# Altium schematic sheet VCO_TOP.SchDoc
size A4
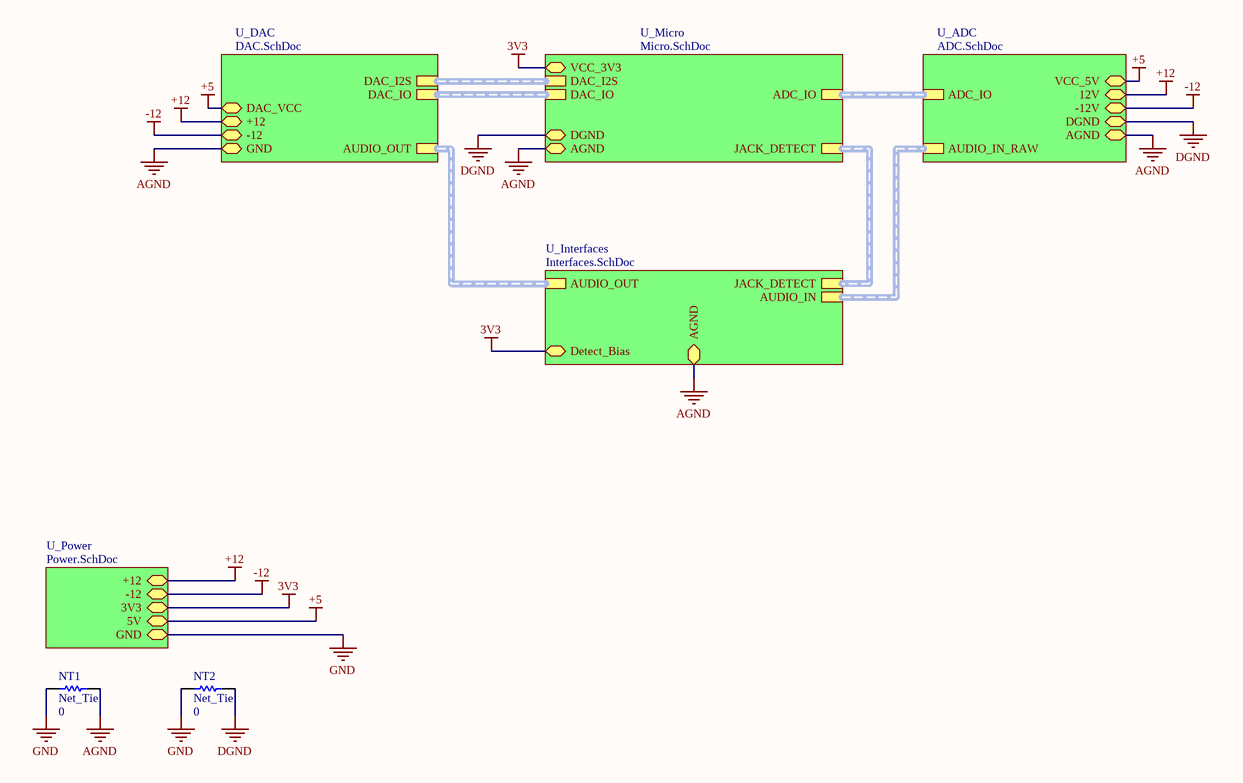
[diagram p0: VCO_TOP.SchDoc]

## Parts
NT1  Net_Tie  value 0  [RES0603R]
NT2  Net_Tie  value 0  [RES0603R]

## Sub-sheets
U_ADC = ADC.SchDoc: AGND (bidir), VCC_5V (bidir), DGND (bidir), ADC_IO (harness ADC_IO), -12V (bidir), 12V (bidir), AUDIO_IN_RAW (harness AUDIO_IN)
U_DAC = DAC.SchDoc: DAC_I2S (harness DAC_I2S), DAC_VCC (bidir), GND (bidir), DAC_IO (harness DAC_IO), -12 (bidir), +12 (bidir), AUDIO_OUT (harness AUDIO_OUT)
U_Interfaces = Interfaces.SchDoc: AGND (bidir), Detect_Bias (bidir), JACK_DETECT (harness JACK_DETECT), AUDIO_OUT (harness AUDIO_OUT), AUDIO_IN (harness AUDIO_IN)
U_Micro = Micro.SchDoc: VCC_3V3 (bidir), DAC_I2S (harness DAC_I2S), DAC_IO (harness DAC_IO), JACK_DETECT (harness JACK_DETECT), ADC_IO (harness ADC_IO), DGND (bidir), AGND (bidir)
U_Power = Power.SchDoc: +12 (bidir), -12 (bidir), GND (bidir), 3V3 (bidir), 5V (bidir)

## Nets
3V3: sheet U_Power/3V3, sheet U_Micro/VCC_3V3, sheet U_Interfaces/Detect_Bias
+5: sheet U_Power/5V, sheet U_DAC/DAC_VCC, sheet U_ADC/VCC_5V
+12: sheet U_Power/+12, sheet U_DAC/+12, sheet U_ADC/12V
-12: sheet U_Power/-12, sheet U_DAC/-12, sheet U_ADC/-12V
AGND: NT1.2 ; sheet U_Micro/AGND, sheet U_DAC/GND, sheet U_ADC/AGND, sheet U_Interfaces/AGND
DGND: NT2.2 ; sheet U_Micro/DGND, sheet U_ADC/DGND
GND: NT1.1 NT2.1 ; sheet U_Power/GND

## Buses and harness runs
harness sheet U_ADC/ADC_IO = sheet U_Micro/ADC_IO
harness sheet U_ADC/AUDIO_IN_RAW = sheet U_Interfaces/AUDIO_IN
harness sheet U_DAC/AUDIO_OUT = sheet U_Interfaces/AUDIO_OUT
harness sheet U_DAC/DAC_I2S = sheet U_Micro/DAC_I2S
harness sheet U_DAC/DAC_IO = sheet U_Micro/DAC_IO
harness sheet U_Interfaces/JACK_DETECT = sheet U_Micro/JACK_DETECT

## Library data of the parts
NT1 NT2 = Res1: Resistor; Published: 8-Jun-2000; LatestRevisionDate: 17-Jul-2002; LatestRevisionNote: Re-released for DXP Platform.; PackageReference: AXIAL-0.3; Publisher: Altium Limited; PackageDescription: Axial Device, Thru-Hole; 2 Leads; 0.3 in Pin Spacing